# EAGLE design tiny_base_21_21 (EAGLE 9.6.2)
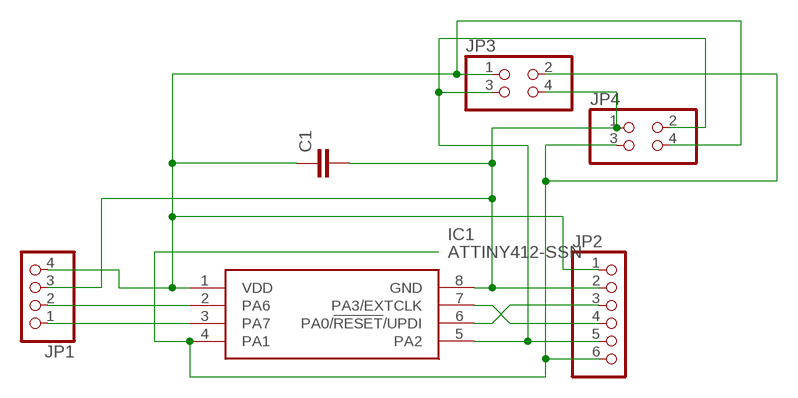
[diagram p0: schematic, sheet 1]

## Parts
C1  C-EUC0805K  [C0805K]
IC1  ATTINY412-SSN  [SOIC127P600X175-8N]
JP1  PINHD-1X4  [1X04]
JP2  PINHD-1X6  [1X06]
JP3  PINHD-2X2  [2X02]
JP4  PINHD-2X2  [2X02]

## Nets
GND: C1.2 IC1.8(GND) JP1.3 JP2.2 JP3.4 JP4.1
P0: IC1.2(PA6) JP1.2
P1: IC1.3(PA7) JP1.1
P4: IC1.7(PA3/EXTCLK) JP2.4
SCL: IC1.5(PA2) JP2.5 JP3.3 JP4.2
SDA: IC1.4(PA1) JP2.6 JP3.2 JP4.3
UPDI: IC1.6(PA0/!RESET!/UPDI) JP2.3
VDD: C1.1 IC1.1(VDD) JP1.4 JP2.1 JP3.1 JP4.4

## Library data of the parts
C1 = rcl:C-EU: CAPACITOR, European symbol; SPICEPREFIX: C
IC1 = ATTINY412-SSN:ATTINY412-SSN: 8-bit Microcontrollers - MCU 20MHz, 4KB, SOIC8, Ind 105C, Green, Tube Source: Datasheet <http://www.microchip.com/mymicrochip/filehandler.aspx?ddocname=en599382>; DESCRIPTION: 8-bit Microcontrollers - MCU 20MHz, 4KB, SOIC8, Ind 105C, Green, Tube; HEIGHT: 1.75mm; MANUFACTURER_NAME: Microchip; MANUFACTURER_PART_NUMBER: ATTINY412-SSN; MOUSER_PART_NUMBER: 579-ATTINY412-SSN; MOUSER_PRICE-STOCK: https://www.mouser.co.uk/ProductDetail/Microchip-Technology/ATTINY412-SSN?qs=3HJ2avRr9PItQG9ZsCamPQ%3D%3D
JP1 = pinhead2:PINHD-1X4: PIN HEADER
JP2 = pinhead2:PINHD-1X6: PIN HEADER
JP3 JP4 = pinhead2:PINHD-2X2: PIN HEADER

## Board
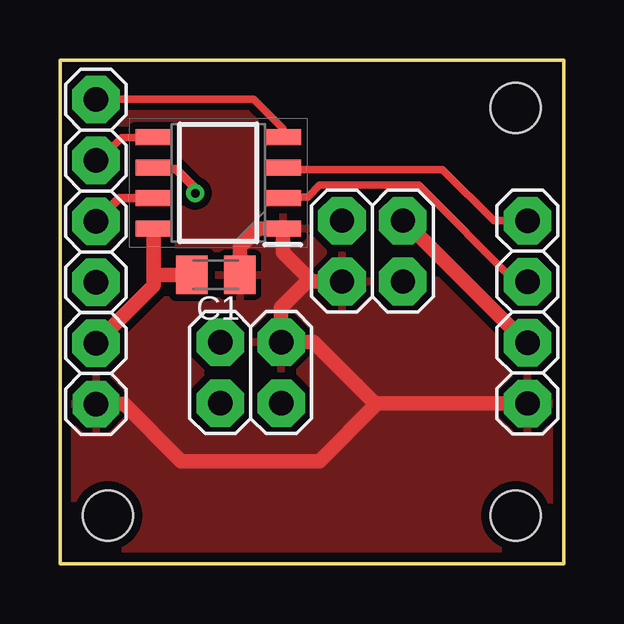
[diagram p1: board, top side]
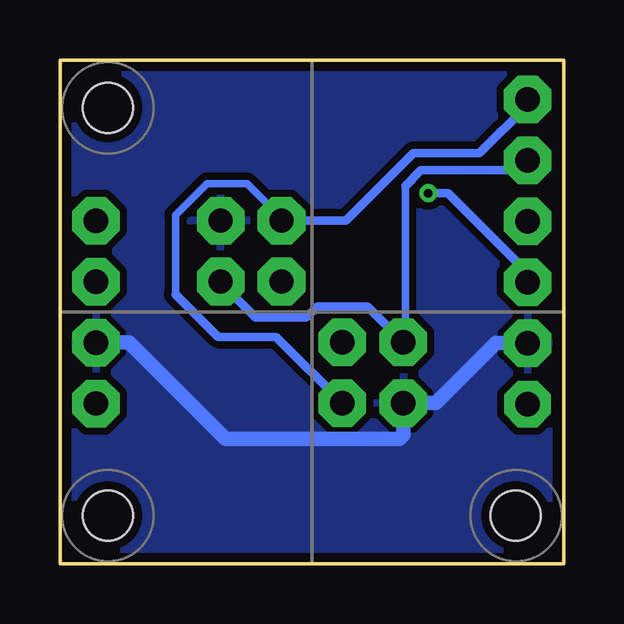
[diagram p2: board, bottom side, seen from below]

Size 21 x 21 mm. Coordinates in mm from the lower left corner, seen from the top.
Outline: 0,0 0,21 21,21 21,0 0,0
Copper layers (1*16): Top 0.035mm / dielectric 1.5mm / Bottom 0.035mm
Design rules "default *": minimum track width 12mil, minimum drill 0.35mm, track to track 12mil, track to pad 12mil, pad to pad 12mil, via to via 12mil, smd to smd 12mil, copper to edge 15mil, drill to drill 40mil, minimum pad ring 10mil, minimum via ring 8mil, stop-mask expansion 4mil, vias tented up to drill 0mil, thermal gap 10mil
Holes 2.1 mm at 2,2 19,19 19,2

### Footprints (pad centres in the part's own frame; a part is rotated, then mirrored left to right if it is on the bottom)
C0805K = smd 1.3 x 1.6: 1 -1,0; 2 1,0
SOIC127P600X175-8N = smd 1.5 x 0.65: 1 -2.7,1.905; 2 -2.7,0.635; 3 -2.7,-0.635; 4 -2.7,-1.905; 5 2.7,-1.905; 6 2.7,-0.635; 7 2.7,0.635; 8 2.7,1.905
1X04 = drill 1.016 pad 1.981 octagon: 1 -3.81,0; 2 -1.27,0; 3 1.27,0; 4 3.81,0
1X06 = drill 1.016 pad 1.93 octagon: 1 -6.35,0 | drill 1.016 pad 1.981 octagon: 2 -3.81,0; 3 -1.27,0; 4 1.27,0; 5 3.81,0; 6 6.35,0
2X02 = drill 1.016 pad 1.981 octagon: 1 -1.27,-1.27; 2 -1.27,1.27; 3 1.27,-1.27; 4 1.27,1.27

### Placement (x,y rotation side)
C1  6.5,12.04 180 top
IC1  6.6,15.88 180 top
JP1  19.5,10.49 270 top
JP2  1.5,13 90 top
JP3  13.03,13.03 0 top
JP4  7.95,7.96 0 top

### Tracks (layer width: path | path; a pad name or v marks a point on that pad's centre or on a via)
GND
  Top 0.61: JP1.3 19.44,9.21 14.35,14.3 JP3.4 | 5.56,12.22 C1.2 3.9,12.04 | IC1.8 3.9,12.04 | 3.9,12.04 3.9,11.59 JP2.2
  Bottom 0.61: JP1.3 18.12,9.21 14.1,5.19 6.85,5.19 6.68,5.36 JP4.1 5.32,6.69 2.82,9.19 JP2.2
  pour Bottom: 0,21 0,0 21,0 21,21
P0
  Top 0.305: JP1.2 18.98,11.76 14.96,15.77 10.82,15.77 10.34,15.29 9.35,15.29 IC1.2
P1
  Top 0.305: IC1.3 9.38,16.43 15.95,16.43 18.09,14.29 JP1.1
P4
  Top 0.356: IC1.7 2.47,15.24 JP2.4
SCL
  Top 0.305: IC1.5 3.87,17.75 2.56,17.75 1.65,16.84 JP2.5
  Bottom 0.305: 6.6,15.75 6.6,9.25 JP4.2
  Bottom 0.356: JP3.3 14.3,11.72 12.84,10.26 10.73,10.26 10.27,10.73 8.18,10.73 JP4.2 | 6.6,15.75 5.94,16.41 1.9,16.41 JP2.5
SDA
  Top 0.305: IC1.4 9.3,18.13 8.08,19.36 JP2.6
  Bottom 0.305: 16.18,11.23 16.18,14.53 14.86,15.85 13.21,15.85 11.89,14.53 JP3.2
  Bottom 0.356: 16.18,11.23 14.4,9.45 11.99,9.45 JP4.3 | JP2.6 1.5,19.12 3.5,17.12 6.25,17.12 9.07,14.3 JP3.2
UPDI  (via drill 0.35)
  Top 0.356: IC1.6 3.96,16.45 4.83,16.45 5.64,15.65 v5.64,15.44
  Bottom 0.356: v5.64,15.44 4.83,15.44 1.5,12.12 JP2.3
VDD
  Top 0.61: C1.1 7.5,13.22 8.26,13.97 IC1.1 9.3,12.98 10.52,11.76 JP3.1 10.31,11.76 9.22,10.67 JP4.4 10.57,9.23 13.13,6.67 JP1.4 13.22,6.67 10.81,4.27 5.06,4.27 2.67,6.65 JP2.1
  pour Top: 0,21 0,0 21,0 21,21

### Text on the board
bDocu: SDA | SCL | P4 | P1 | UPDI | P0 | GND | GND | VCC | VCC